# Altium schematic sheet HGCD.SchDoc
size A4
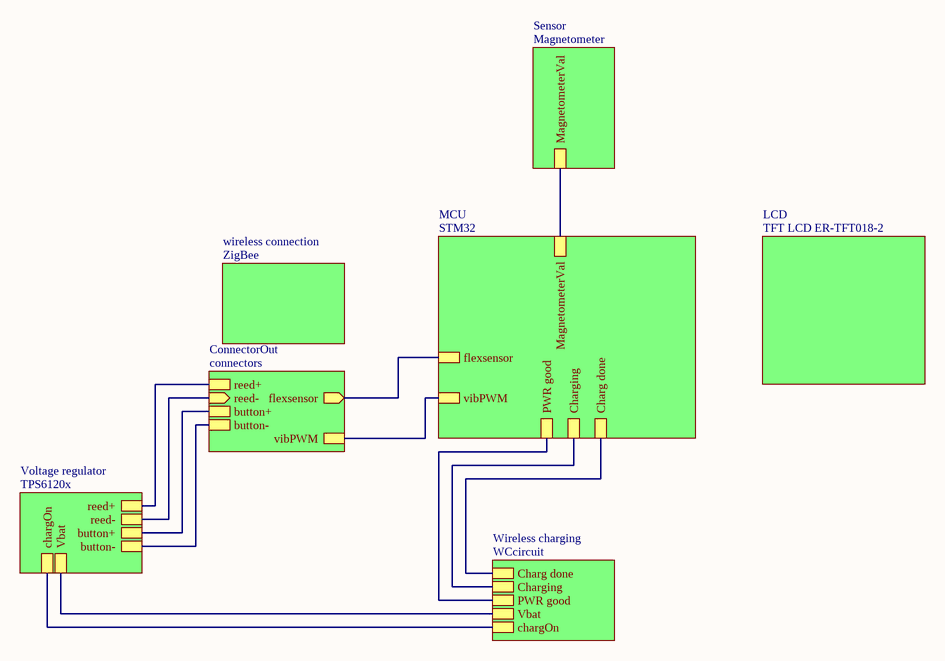
[diagram p0: HGCD.SchDoc]

## Sub-sheets
ConnectorOut = connectors: reed- (in), reed+, flexsensor (out), vibPWM, button+, button-
LCD = TFT LCD ER-TFT018-2: no entries
MCU = STM32: flexsensor, vibPWM, MagnetometerVal, Charg done, Charging, PWR good
Sensor = Magnetometer: MagnetometerVal
Voltage regulator = TPS6120x: Vbat, reed-, reed+, button-, button+, chargOn
Wireless charging = WCcircuit: Charg done, Charging, PWR good, Vbat, chargOn
wireless connection = ZigBee: no entries

## Nets
(unnamed): sheet ConnectorOut/reed-, sheet Voltage regulator/reed-
(unnamed): sheet ConnectorOut/reed+, sheet Voltage regulator/reed+
(unnamed): sheet ConnectorOut/flexsensor, sheet MCU/flexsensor
(unnamed): sheet ConnectorOut/vibPWM, sheet MCU/vibPWM
(unnamed): sheet ConnectorOut/button+, sheet Voltage regulator/button+
(unnamed): sheet ConnectorOut/button-, sheet Voltage regulator/button-
(unnamed): sheet MCU/MagnetometerVal, sheet Sensor/MagnetometerVal
(unnamed): sheet MCU/Charg done, sheet Wireless charging/Charg done
(unnamed): sheet MCU/Charging, sheet Wireless charging/Charging
(unnamed): sheet MCU/PWR good, sheet Wireless charging/PWR good
(unnamed): sheet Voltage regulator/Vbat, sheet Wireless charging/Vbat
(unnamed): sheet Voltage regulator/chargOn, sheet Wireless charging/chargOn